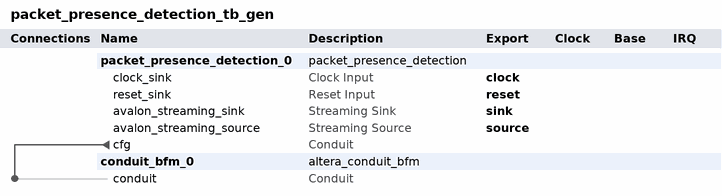
[diagram p0: system contents]
# Platform Designer (Qsys) system packet_presence_detection_tb_gen, MAX 10 10M16SAU169C8G
# Parameters at their usual value, and those the tool derives, are not listed.
package require -exact qsys 18.1
create_system packet_presence_detection_tb_gen
set_project_property DEVICE_FAMILY {MAX 10}
set_project_property DEVICE 10M16SAU169C8G

add_instance packet_presence_detection_0 packet_presence_detection 1.0
set_instance_parameter_value packet_presence_detection_0 DATA_WIDTH 12
set_instance_parameter_value packet_presence_detection_0 PASSTHROUGH_LEN_WIDTH 16

add_instance conduit_bfm_0 altera_conduit_bfm 18.1
set_instance_parameter_value conduit_bfm_0 CLOCKED_SIGNAL false
set_instance_parameter_value conduit_bfm_0 ENABLE_RESET false
set_instance_parameter_value conduit_bfm_0 SIGNAL_DIRECTIONS output,output,output,output,input,input,input
set_instance_parameter_value conduit_bfm_0 SIGNAL_ROLES cfg_enable,cfg_threshold,cfg_clear_rs,cfg_passthrough_len,debug_short_sum,debug_count,debug_long_sum
set_instance_parameter_value conduit_bfm_0 SIGNAL_WIDTHS 1,8,1,16,32,32,32

# connections
add_connection packet_presence_detection_0.cfg conduit_bfm_0.conduit conduit

# exported interfaces
add_interface clock clock sink
set_interface_property clock EXPORT_OF packet_presence_detection_0.clock_sink
add_interface reset reset sink
set_interface_property reset EXPORT_OF packet_presence_detection_0.reset_sink
add_interface sink avalon_streaming sink
set_interface_property sink EXPORT_OF packet_presence_detection_0.avalon_streaming_sink
add_interface source avalon_streaming source
set_interface_property source EXPORT_OF packet_presence_detection_0.avalon_streaming_source

set_interconnect_requirement {$system} qsys_mm.clockCrossingAdapter HANDSHAKE
set_interconnect_requirement {$system} qsys_mm.enableEccProtection FALSE
set_interconnect_requirement {$system} qsys_mm.insertDefaultSlave FALSE
set_interconnect_requirement {$system} qsys_mm.maxAdditionalLatency 1

save_system packet_presence_detection_tb_gen.qsys
